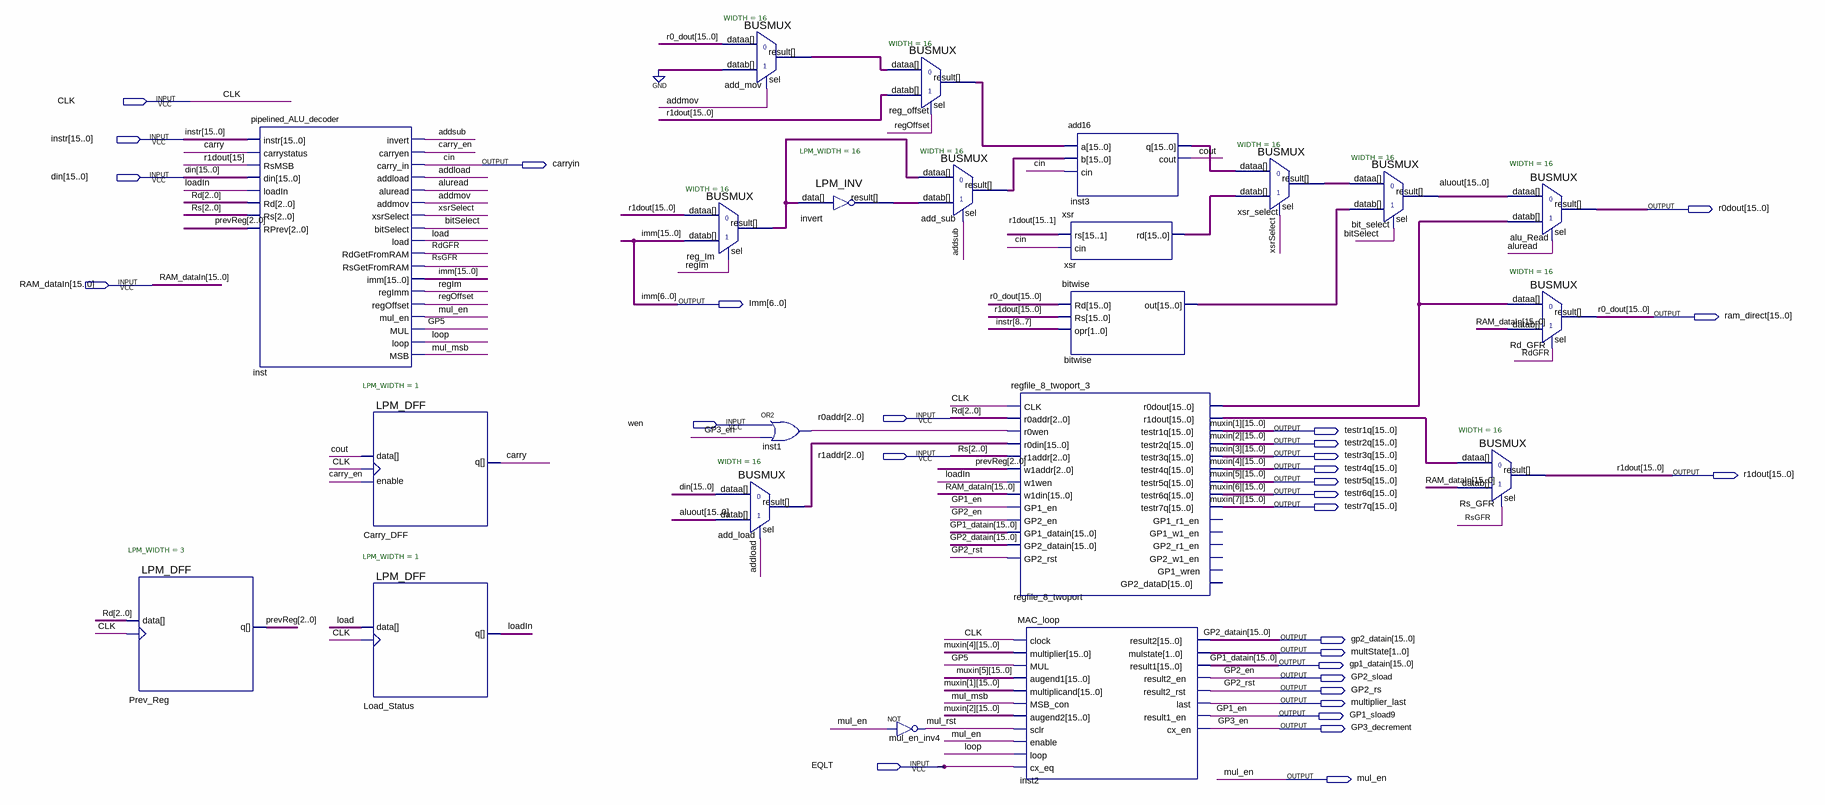
[diagram p0: schematic sheet]
// Quartus schematic pipelined_ALU_regfile.bdf as structural Verilog: 22 symbols, 29 pins
module pipelined_ALU_regfile (
  input  CLK,
  input  [15:0] instr,
  input  [15:0] din,
  input  [15:0] RAM_dataIn,
  input  [2:0] r0addr,
  input  wen,
  input  [2:0] r1addr,
  input  EQLT,
  output carryin,
  output [15:0] r0dout,
  output [15:0] Imm,
  output [15:0] ram_direct,
  output [15:0] testr1q,
  output [15:0] testr2q,
  output [15:0] testr3q,
  output [15:0] testr4q,
  output [15:0] r1dout,
  output [15:0] testr5q,
  output [15:0] testr6q,
  output [15:0] testr7q,
  output [15:0] gp2_datain,
  output [1:0] multState,
  output [15:0] gp1_datain,
  output GP2_sload,
  output GP2_rs,
  output multiplier_last,
  output GP1_sload9,
  output GP3_decrement,
  output mul_en
);

  wire addload, addmov, addsub, aluread, bitSelect, carry, carry_en, cout, GP5, inst1_out, load, loadIn,
       loop, mul_msb, mul_rst, RdGFR, regIm, regOffset, RsGFR, xsrSelect;
  wire [2:0] prevReg;
  wire [15:0] add_load_result, add_mov_result, add_sub_result, aluout, bitwise_out, inst3_q, invert_result,
       reg_Im_result, reg_offset_result, regfile_8_twoport_r0dout, regfile_8_twoport_r1dout, xsr_rd,
       xsr_select_result;

  LPM_DFF #(.LPM_WIDTH(3)) Prev_Reg (.clock(CLK), .data(r0addr), .q(prevReg));
  pipelined_ALU_decoder inst (
    .instr(instr), .carrystatus(carry), .RsMSB(r1dout[15]), .din(din), .loadIn(loadIn), .Rd(r0addr),
    .Rs(r1addr), .RPrev(prevReg), .invert(addsub), .carryen(carry_en), .carry_in(carryin), .addload(addload),
    .aluread(aluread), .addmov(addmov), .xsrSelect(xsrSelect), .bitSelect(bitSelect), .load(load),
    .RdGetFromRAM(RdGFR), .RsGetFromRAM(RsGFR), .imm(Imm), .regImm(regIm), .regOffset(regOffset),
    .mul_en(mul_en), .MUL(GP5), .loop(loop), .MSB(mul_msb));
  LPM_DFF #(.LPM_WIDTH(1)) Carry_DFF (.enable(carry_en), .clock(CLK), .data(cout), .q(carry));
  LPM_DFF #(.LPM_WIDTH(1)) Load_Status (.clock(CLK), .data(load), .q(loadIn));
  BUSMUX #(.WIDTH(16)) reg_Im (.datab(Imm), .sel(regIm), .dataa(r1dout), .result(reg_Im_result));
  BUSMUX #(.WIDTH(16)) add_mov (.datab({16{1'b0}}), .sel(addmov), .dataa(ram_direct), .result(add_mov_result));
  BUSMUX #(.WIDTH(16)) add_load (.datab(aluout), .sel(addload), .dataa(din), .result(add_load_result));
  LPM_INV #(.LPM_WIDTH(16)) invert (.data(reg_Im_result), .result(invert_result));
  or inst1 (inst1_out, wen, GP3_decrement);
  BUSMUX #(.WIDTH(16)) reg_offset (.datab(r1dout), .sel(regOffset), .dataa(add_mov_result), .result(reg_offset_result));
  not mul_en_inv4 (mul_rst, mul_en);
  BUSMUX #(.WIDTH(16)) add_sub (.datab(invert_result), .sel(addsub), .dataa(reg_Im_result), .result(add_sub_result));
  regfile_8_twoport_3 regfile_8_twoport (
    .CLK(CLK), .r0addr(r0addr), .r0wen(inst1_out), .r0din(add_load_result), .r1addr(r1addr),
    .w1addr(prevReg), .w1wen(loadIn), .w1din(RAM_dataIn), .GP1_en(GP1_sload9), .GP2_en(GP2_sload),
    .GP1_datain(gp1_datain), .GP2_datain(gp2_datain), .GP2_rst(GP2_rs), .r0dout(regfile_8_twoport_r0dout),
    .r1dout(regfile_8_twoport_r1dout), .testr1q(testr1q), .testr2q(testr2q), .testr3q(testr3q),
    .testr4q(testr4q), .testr5q(testr5q), .testr6q(testr6q), .testr7q(testr7q));  // open: GP1_r1_en, GP1_w1_en, GP2_r1_en, GP2_w1_en, GP1_wren, GP2_dataD
  MAC_loop inst2 (
    .clock(CLK), .multiplier(testr4q), .MUL(GP5), .augend1(testr5q), .multiplicand(testr1q),
    .MSB_con(mul_msb), .augend2(testr2q), .sclr(mul_rst), .enable(mul_en), .loop(loop), .cx_eq(EQLT),
    .result2(gp2_datain), .mulstate(multState), .result1(gp1_datain), .result2_en(GP2_sload),
    .result2_rst(GP2_rs), .last(multiplier_last), .result1_en(GP1_sload9), .cx_en(GP3_decrement));
  add16 inst3 (.a(reg_offset_result), .b(add_sub_result), .cin(carryin), .q(inst3_q), .cout(cout));
  xsr xsr (.rs(r1dout[15:1]), .cin(carryin), .rd(xsr_rd));
  bitwise bitwise (.Rd(ram_direct), .Rs(r1dout), .opr(instr[8:7]), .out(bitwise_out));
  BUSMUX #(.WIDTH(16)) xsr_select (.datab(xsr_rd), .sel(xsrSelect), .dataa(inst3_q), .result(xsr_select_result));
  BUSMUX #(.WIDTH(16)) bit_select (.datab(bitwise_out), .sel(bitSelect), .dataa(xsr_select_result), .result(aluout));
  BUSMUX #(.WIDTH(16)) Rs_GFR (.datab(RAM_dataIn), .sel(RsGFR), .dataa(regfile_8_twoport_r1dout), .result(r1dout));
  BUSMUX #(.WIDTH(16)) alu_Read (.datab(regfile_8_twoport_r0dout), .sel(aluread), .dataa(aluout), .result(r0dout));
  BUSMUX #(.WIDTH(16)) Rd_GFR (.datab(RAM_dataIn), .sel(RdGFR), .dataa(regfile_8_twoport_r0dout), .result(ram_direct));

  // Other names for the same wires on the sheet: cin = carryin; GP1_en = GP1_sload9; GP2_en = GP2_sload;
  //   GP2_rst = GP2_rs; GP3_en = GP3_decrement; muxin_1[15:0] = testr1q; muxin_2[15:0] = testr2q;
  //   muxin_3[15:0] = testr3q; muxin_4[15:0] = testr4q; muxin_5[15:0] = testr5q; muxin_6[15:0] = testr6q;
  //   muxin_7[15:0] = testr7q; r0_dout[15:0] = ram_direct; Rd[2:0] = r0addr; Rs[2:0] = r1addr
endmodule
